# EAGLE schematic MyEasyPort (EAGLE 6.4)
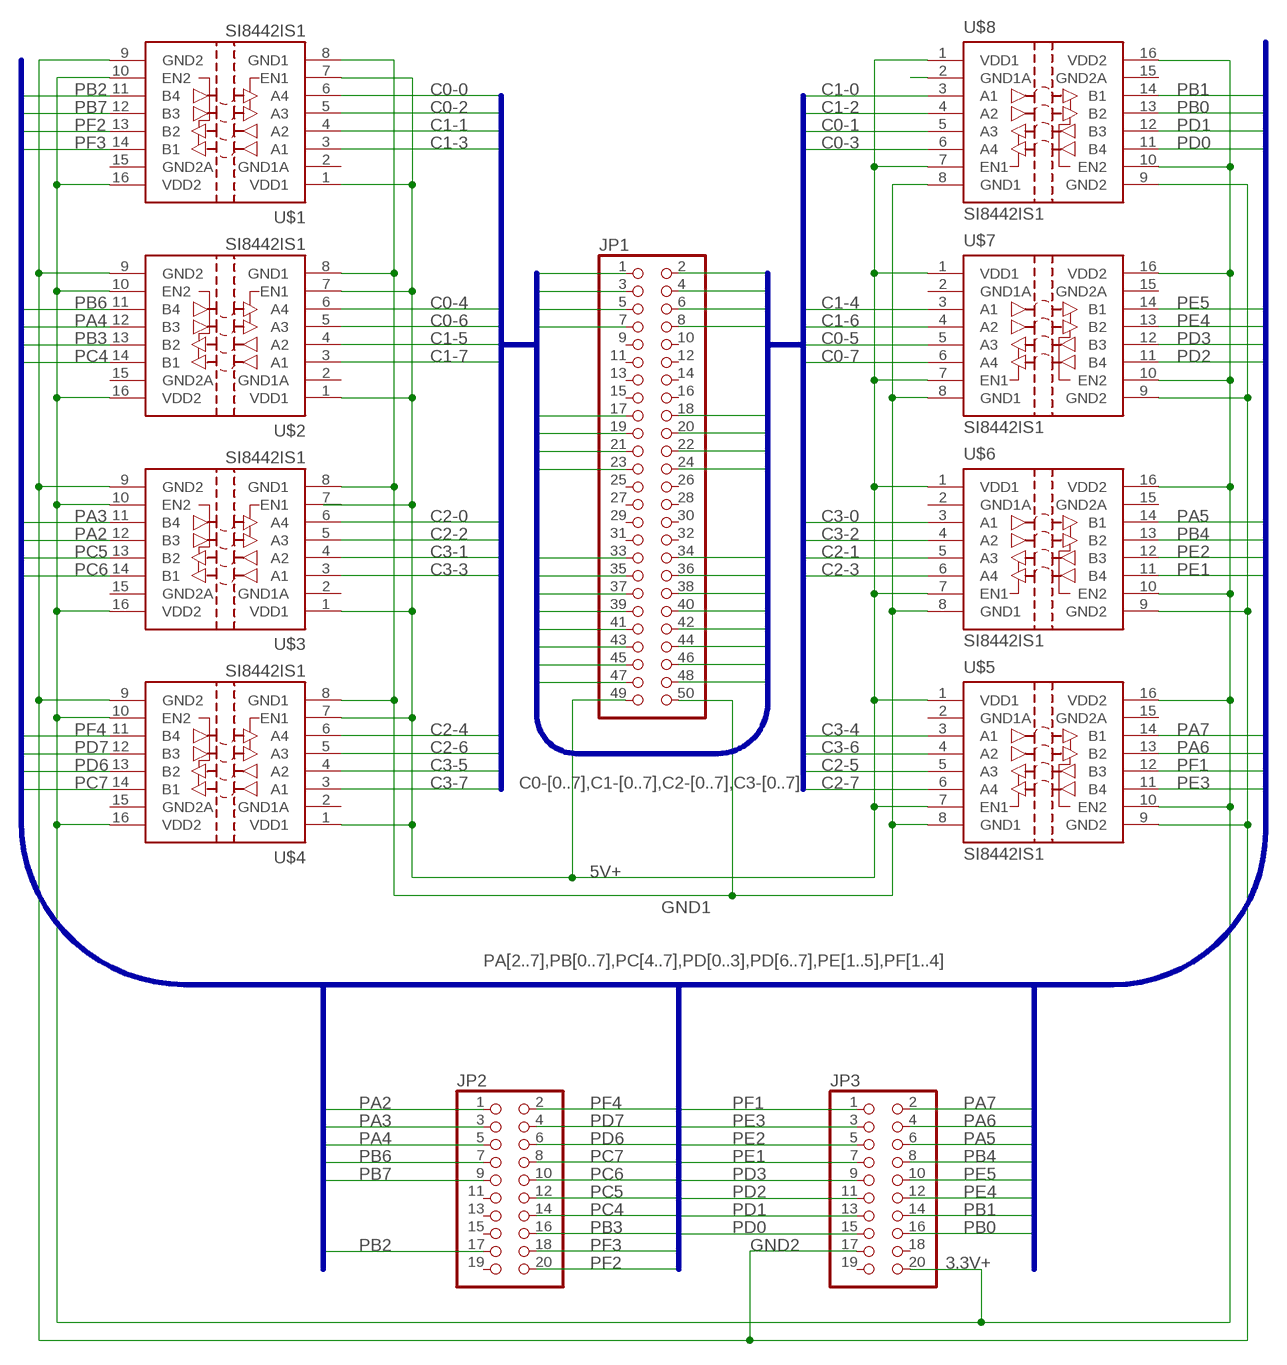
[diagram p0: schematic, sheet 1]

## Parts
JP1  PINHD-2X25  [2X25]
JP2  PINHD-2X10  [2X10]
JP3  PINHD-2X10  [2X10]
U$1  SI8442IS1  [SO16]
U$2  SI8442IS1  [SO16]
U$3  SI8442IS1  [SO16]
U$4  SI8442IS1  [SO16]
U$5  SI8442IS1  [SO16]
U$6  SI8442IS1  [SO16]
U$7  SI8442IS1  [SO16]
U$8  SI8442IS1  [SO16]

## Nets
3.3V+: JP3.20 U$1.10(EN2) U$1.16(VDD2) U$2.10(EN2) U$2.16(VDD2) U$3.10(EN2) U$3.16(VDD2) U$4.10(EN2) U$4.16(VDD2) U$5.10(EN2) U$5.16(VDD2) U$6.10(EN2) U$6.16(VDD2) U$7.10(EN2) U$7.16(VDD2) U$8.10(EN2) U$8.16(VDD2)
5V+: JP1.49 U$1.1(VDD1) U$1.7(EN1) U$2.1(VDD1) U$2.7(EN1) U$3.1(VDD1) U$4.1(VDD1) U$4.7(EN1) U$5.1(VDD1) U$5.7(EN1) U$6.1(VDD1) U$6.7(EN1) U$7.1(VDD1) U$7.7(EN1) U$8.1(VDD1) U$8.7(EN1)
C0-0: JP1.1 U$1.6(A4)
C0-1: JP1.6 U$8.5(A3)
C0-2: JP1.3 U$1.5(A3)
C0-3: JP1.8 U$8.6(A4)
C0-4: JP1.17 U$2.6(A4)
C0-5: JP1.22 U$7.5(A3)
C0-6: JP1.19 U$2.5(A3)
C0-7: JP1.24 U$7.6(A4)
C1-0: JP1.2 U$8.3(A1)
C1-1: JP1.5 U$1.4(A2)
C1-2: JP1.4 U$8.4(A2)
C1-3: JP1.7 U$1.3(A1)
C1-4: JP1.18 U$7.3(A1)
C1-5: JP1.21 U$2.4(A2)
C1-6: JP1.20 U$7.4(A2)
C1-7: JP1.23 U$2.3(A1)
C2-0: JP1.33 U$3.6(A4)
C2-1: JP1.38 U$6.5(A3)
C2-2: JP1.35 U$3.5(A3)
C2-3: JP1.40 U$6.6(A4)
C2-4: JP1.41 U$4.6(A4)
C2-5: JP1.46 U$5.5(A3)
C2-6: JP1.43 U$4.5(A3)
C2-7: JP1.48 U$5.6(A4)
C3-0: JP1.34 U$6.3(A1)
C3-1: JP1.37 U$3.4(A2)
C3-2: JP1.36 U$6.4(A2)
C3-3: JP1.39 U$3.3(A1)
C3-4: JP1.42 U$5.3(A1)
C3-5: JP1.45 U$4.4(A2)
C3-6: JP1.44 U$5.4(A2)
C3-7: JP1.47 U$4.3(A1)
GND1: JP1.50 U$1.8(GND1) U$2.8(GND1) U$3.8(GND1) U$4.8(GND1) U$5.8(GND1) U$6.8(GND1) U$7.8(GND1) U$8.8(GND1)
GND1A: U$8.2(GND1A)
GND2: JP3.17 U$1.9(GND2) U$2.9(GND2) U$3.9(GND2) U$4.9(GND2) U$5.9(GND2) U$6.9(GND2) U$7.9(GND2) U$8.9(GND2)
PA2: JP2.1 U$3.12(B3)
PA3: JP2.3 U$3.11(B4)
PA4: JP2.5 U$2.12(B3)
PA5: JP3.6 U$6.14(B1)
PA6: JP3.4 U$5.13(B2)
PA7: JP3.2 U$5.14(B1)
PB0: JP3.16 U$8.13(B2)
PB1: JP3.14 U$8.14(B1)
PB2: JP2.17 U$1.11(B4)
PB3: JP2.16 U$2.13(B2)
PB4: JP3.8 U$6.13(B2)
PB6: JP2.7 U$2.11(B4)
PB7: JP2.9 U$1.12(B3)
PC4: JP2.14 U$2.14(B1)
PC5: JP2.12 U$3.13(B2)
PC6: JP2.10 U$3.14(B1)
PC7: JP2.8 U$4.14(B1)
PD0: JP3.15 U$8.11(B4)
PD1: JP3.13 U$8.12(B3)
PD2: JP3.11 U$7.11(B4)
PD3: JP3.9 U$7.12(B3)
PD6: JP2.6 U$4.13(B2)
PD7: JP2.4 U$4.12(B3)
PE1: JP3.7 U$6.11(B4)
PE2: JP3.5 U$6.12(B3)
PE3: JP3.3 U$5.11(B4)
PE4: JP3.12 U$7.13(B2)
PE5: JP3.10 U$7.14(B1)
PF1: JP3.1 U$5.12(B3)
PF2: JP2.20 U$1.13(B2)
PF3: JP2.18 U$1.14(B1)
PF4: JP2.2 U$4.11(B4)
Unconnected: JP1.9 JP1.10 JP1.11 JP1.12 JP1.13 JP1.14 JP1.15 JP1.16 JP1.25 JP1.26 JP1.27 JP1.28 JP1.29 JP1.30 JP1.31 JP1.32 JP2.11 JP2.13 JP2.15 JP2.19 JP3.18 JP3.19 U$1.2(GND1A) U$1.15(GND2A) U$2.2(GND1A) U$2.15(GND2A) U$3.2(GND1A) U$3.7(EN1) U$3.15(GND2A) U$4.2(GND1A) U$4.15(GND2A) U$5.2(GND1A) U$5.15(GND2A) U$6.2(GND1A) U$6.15(GND2A) U$7.2(GND1A) U$7.15(GND2A) U$8.15(GND2A)

## Buses
C0-[0..7],C1-[0..7],C2-[0..7],C3-[0..7]
PA[2..7],PB[0..7],PC[4..7],PD[0..3],PD[6..7],PE[1..5],PF[1..4]

## Library data of the parts
JP1 = pinhead:PINHD-2X25: PIN HEADER
JP2 JP3 = pinhead:PINHD-2X10: PIN HEADER
U$1-U$8 = silicon-labs:SI8442: Si8442 4 Channel (2/2) Digital Isolator Silicon Labs Si84xx ISOpro digital isolator series. The Si84xx ISOpro digital isolators provide low power galvanic isolation for digital signals. The '42 part has two signals in each direction with output enables. They come in speeds of 1Mbps and 150Mbps, and isolation ratings of 1KV, 2.5KV and 5KV. The independent sides use 2.7-5.5V supplies and draw under 5mA per channel. http://www.silabs.com/Support%20Documents/TechnicalDocs/Si824x.pdf Donald Becker